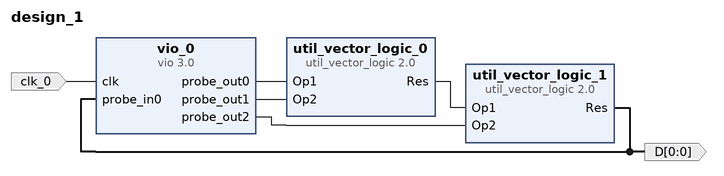
[diagram p0: block diagram of the top level]
# Vivado block design design_1, xc7a100tcsg324-1, Vivado 2023.1
create_bd_design design_1

create_bd_port -dir O -from 0 -to 0 D
create_bd_port -dir I -type clk clk_0

create_bd_cell -type ip -vlnv xilinx.com:ip:util_vector_logic:2.0 util_vector_logic_0
set_property -dict {CONFIG.C_SIZE 1} [get_bd_cells util_vector_logic_0]
create_bd_cell -type ip -vlnv xilinx.com:ip:util_vector_logic:2.0 util_vector_logic_1
set_property -dict {CONFIG.C_OPERATION or CONFIG.C_SIZE 1} [get_bd_cells util_vector_logic_1]
create_bd_cell -type ip -vlnv xilinx.com:ip:vio:3.0 vio_0
set_property -dict {CONFIG.C_NUM_PROBE_OUT 3} [get_bd_cells vio_0]

# ---- connections ----

connect_bd_net -net clk_0_1 [get_bd_ports clk_0] [get_bd_pins vio_0/clk]
connect_bd_net [get_bd_pins util_vector_logic_0/Res] [get_bd_pins util_vector_logic_1/Op1]
connect_bd_net [get_bd_pins util_vector_logic_1/Res] [get_bd_ports D] [get_bd_pins vio_0/probe_in0]
connect_bd_net [get_bd_pins vio_0/probe_out0] [get_bd_pins util_vector_logic_0/Op1]
connect_bd_net [get_bd_pins vio_0/probe_out1] [get_bd_pins util_vector_logic_0/Op2]
connect_bd_net [get_bd_pins vio_0/probe_out2] [get_bd_pins util_vector_logic_1/Op2]

validate_bd_design
save_bd_design
